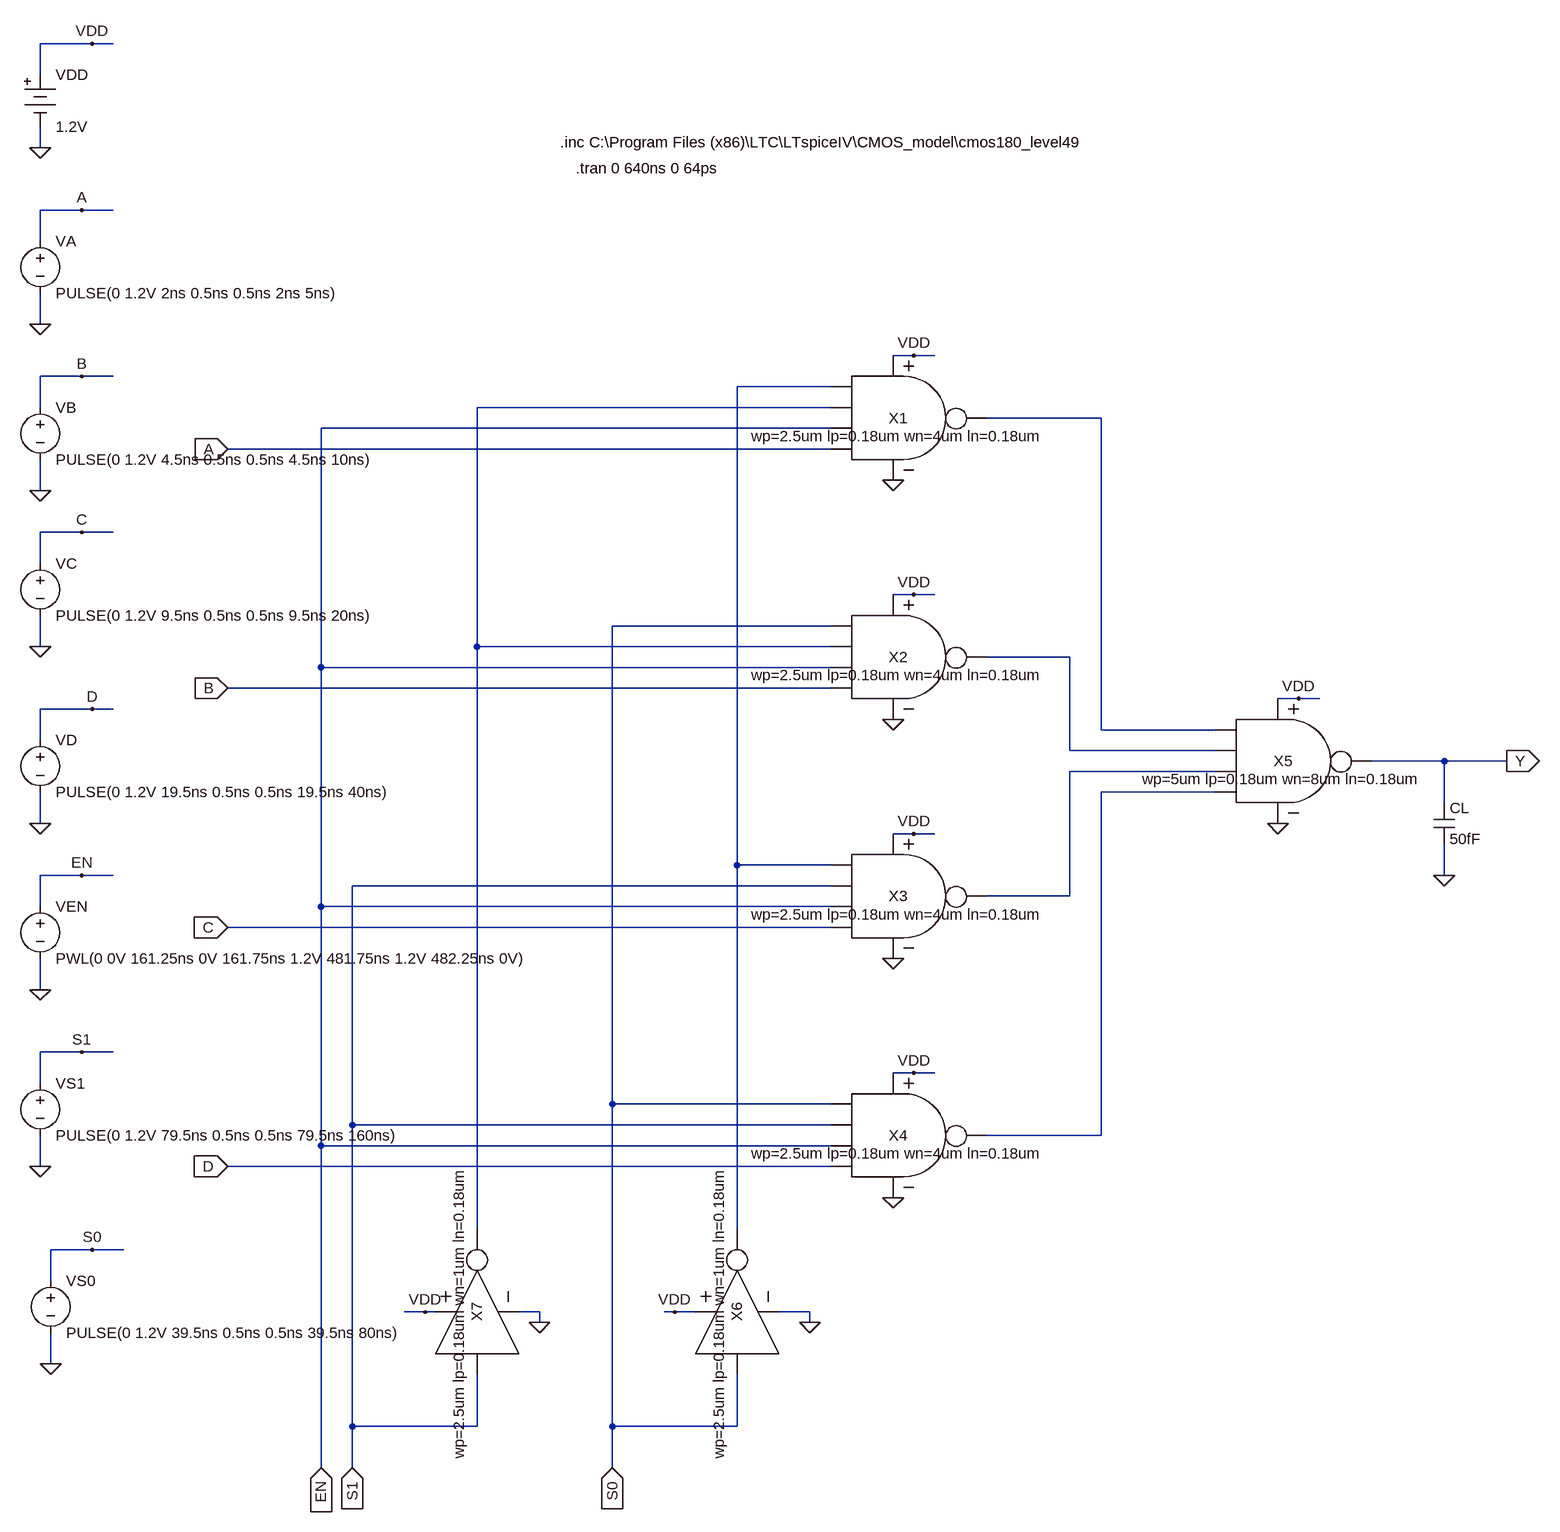
[diagram p0: schematic lab2.asc]
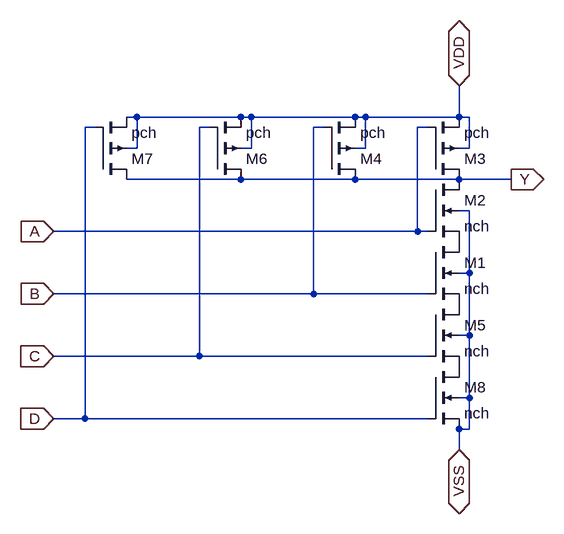
[diagram p1: sub-circuit nand4.asc]
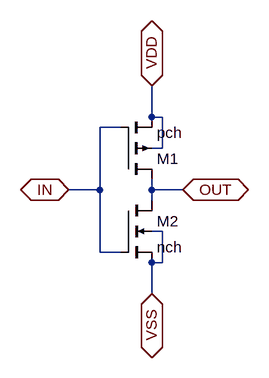
[diagram p2: sub-circuit inv.asc]
lab2.asc, the LTspice schematic file:
Version 4
SHEET 1 2472 2064
WIRE -272 -224 -352 -224
WIRE -240 -224 -272 -224
WIRE -352 -176 -352 -224
WIRE -352 -64 -352 -96
WIRE -288 32 -352 32
WIRE -240 32 -288 32
WIRE -352 80 -352 32
WIRE -352 208 -352 160
WIRE 992 256 960 256
WIRE 1024 256 992 256
WIRE -288 288 -352 288
WIRE -240 288 -288 288
WIRE 864 304 720 304
WIRE -352 336 -352 288
WIRE 864 336 320 336
WIRE 1280 352 1104 352
WIRE 864 368 80 368
WIRE 864 400 -64 400
WIRE -352 464 -352 416
WIRE -288 528 -352 528
WIRE -240 528 -288 528
WIRE -352 576 -352 528
WIRE 992 624 960 624
WIRE 1024 624 992 624
WIRE 864 672 528 672
WIRE -352 704 -352 656
WIRE 320 704 320 336
WIRE 864 704 320 704
WIRE 1232 720 1104 720
WIRE 80 736 80 368
WIRE 864 736 80 736
WIRE 864 768 -64 768
WIRE 1584 784 1552 784
WIRE 1616 784 1584 784
WIRE -272 800 -352 800
WIRE -240 800 -272 800
WIRE 1280 832 1280 352
WIRE 1456 832 1280 832
WIRE -352 848 -352 800
WIRE 1232 864 1232 720
WIRE 1456 864 1232 864
WIRE 1808 880 1696 880
WIRE 1904 880 1808 880
WIRE 1456 896 1232 896
WIRE 1456 928 1280 928
WIRE 1808 944 1808 880
WIRE -352 976 -352 928
WIRE 992 992 960 992
WIRE 1024 992 992 992
WIRE 720 1040 720 304
WIRE 864 1040 720 1040
WIRE -288 1056 -352 1056
WIRE -240 1056 -288 1056
WIRE 1808 1056 1808 1008
WIRE 864 1072 128 1072
WIRE 1232 1088 1232 896
WIRE 1232 1088 1104 1088
WIRE -352 1104 -352 1056
WIRE 80 1104 80 736
WIRE 864 1104 80 1104
WIRE 864 1136 -64 1136
WIRE -352 1232 -352 1184
WIRE -288 1328 -352 1328
WIRE -240 1328 -288 1328
WIRE 992 1360 960 1360
WIRE 1024 1360 992 1360
WIRE -352 1376 -352 1328
WIRE 528 1408 528 672
WIRE 864 1408 528 1408
WIRE 128 1440 128 1072
WIRE 864 1440 128 1440
WIRE 1280 1456 1280 928
WIRE 1280 1456 1104 1456
WIRE 80 1472 80 1104
WIRE 864 1472 80 1472
WIRE -352 1504 -352 1456
WIRE 864 1504 -64 1504
WIRE 320 1600 320 704
WIRE 720 1600 720 1040
WIRE -272 1632 -336 1632
WIRE -224 1632 -272 1632
WIRE -336 1680 -336 1632
WIRE 240 1728 208 1728
WIRE 256 1728 240 1728
WIRE 416 1728 384 1728
WIRE 624 1728 608 1728
WIRE 656 1728 624 1728
WIRE 832 1728 784 1728
WIRE 416 1744 416 1728
WIRE 832 1744 832 1728
WIRE -336 1808 -336 1760
WIRE 128 1904 128 1440
WIRE 320 1904 320 1824
WIRE 320 1904 128 1904
WIRE 528 1904 528 1408
WIRE 720 1904 720 1824
WIRE 720 1904 528 1904
WIRE 80 1968 80 1472
WIRE 128 1968 128 1904
WIRE 528 1968 528 1904
FLAG -352 -64 0
FLAG -272 -224 VDD
FLAG -352 208 0
FLAG -352 464 0
FLAG -352 704 0
FLAG -352 976 0
FLAG -352 1232 0
FLAG -352 1504 0
FLAG -336 1808 0
FLAG -288 32 A
FLAG -288 288 B
FLAG -288 528 C
FLAG -272 800 D
FLAG -288 1056 EN
FLAG -288 1328 S1
FLAG -272 1632 S0
FLAG 960 448 0
FLAG 960 816 0
FLAG 960 1184 0
FLAG 960 1552 0
FLAG 992 256 VDD
FLAG 992 624 VDD
FLAG 992 992 VDD
FLAG 992 1360 VDD
FLAG 1552 976 0
FLAG 1584 784 VDD
FLAG 1808 1056 0
FLAG 1904 880 Y
IOPIN 1904 880 Out
FLAG 240 1728 VDD
FLAG 624 1728 VDD
FLAG 832 1744 0
FLAG 416 1744 0
FLAG 80 1968 EN
IOPIN 80 1968 In
FLAG -64 400 A
IOPIN -64 400 In
FLAG 128 1968 S1
IOPIN 128 1968 In
FLAG 528 1968 S0
IOPIN 528 1968 In
FLAG -64 768 B
IOPIN -64 768 In
FLAG -64 1136 C
IOPIN -64 1136 In
FLAG -64 1504 D
IOPIN -64 1504 In
SYMBOL Misc\\battery -352 -192 R0
WINDOW 123 0 0 Left 2
WINDOW 39 0 0 Left 2
SYMATTR InstName VDD
SYMATTR Value 1.2V
SYMBOL voltage -352 64 R0
WINDOW 123 0 0 Left 2
WINDOW 39 0 0 Left 2
SYMATTR InstName VA
SYMATTR Value PULSE(0 1.2V 2ns 0.5ns 0.5ns 2ns 5ns)
SYMBOL voltage -352 320 R0
SYMATTR InstName VB
SYMATTR Value PULSE(0 1.2V 4.5ns 0.5ns 0.5ns 4.5ns 10ns)
SYMBOL voltage -352 560 R0
SYMATTR InstName VC
SYMATTR Value PULSE(0 1.2V 9.5ns 0.5ns 0.5ns 9.5ns 20ns)
SYMBOL voltage -352 832 R0
SYMATTR InstName VD
SYMATTR Value PULSE(0 1.2V 19.5ns 0.5ns 0.5ns 19.5ns 40ns)
SYMBOL voltage -352 1088 R0
WINDOW 123 0 0 Left 2
WINDOW 39 0 0 Left 2
SYMATTR InstName VEN
SYMATTR Value PWL(0 0V 161.25ns 0V 161.75ns 1.2V 481.75ns 1.2V 482.25ns 0V)
SYMBOL voltage -352 1360 R0
WINDOW 123 0 0 Left 2
WINDOW 39 0 0 Left 2
SYMATTR InstName VS1
SYMATTR Value PULSE(0 1.2V 79.5ns 0.5ns 0.5ns 79.5ns 160ns)
SYMBOL voltage -336 1664 R0
WINDOW 123 0 0 Left 2
WINDOW 39 0 0 Left 2
SYMATTR InstName VS0
SYMATTR Value PULSE(0 1.2V 39.5ns 0.5ns 0.5ns 39.5ns 80ns)
SYMBOL nand4 976 352 R0
WINDOW 39 -8 28 Center 2
SYMATTR SpiceLine wp=2.5um lp=0.18um wn=4um ln=0.18um
SYMATTR InstName X1
SYMBOL nand4 976 720 R0
WINDOW 39 -8 28 Center 2
SYMATTR SpiceLine wp=2.5um lp=0.18um wn=4um ln=0.18um
SYMATTR InstName X2
SYMBOL nand4 976 1088 R0
WINDOW 39 -8 28 Center 2
SYMATTR SpiceLine wp=2.5um lp=0.18um wn=4um ln=0.18um
SYMATTR InstName X3
SYMBOL nand4 976 1456 R0
WINDOW 39 -8 28 Center 2
SYMATTR SpiceLine wp=2.5um lp=0.18um wn=4um ln=0.18um
SYMATTR InstName X4
SYMBOL nand4 1568 880 R0
WINDOW 39 -8 28 Center 2
SYMATTR SpiceLine wp=5um lp=0.18um wn=8um ln=0.18um
SYMATTR InstName X5
SYMBOL cap 1792 944 R0
SYMATTR InstName CL
SYMATTR Value 50fF
SYMBOL inv 720 1728 R270
WINDOW 39 0 -28 Center 2
SYMATTR SpiceLine wp=2.5um lp=0.18um wn=1um ln=0.18um
SYMATTR InstName X6
SYMBOL inv 320 1728 R270
WINDOW 39 0 -28 Center 2
SYMATTR SpiceLine wp=2.5um lp=0.18um wn=1um ln=0.18um
SYMATTR InstName X7
TEXT 448 -72 Left 2 !.inc C:\\Program Files (x86)\\LTC\\LTspiceIV\\CMOS_model\\cmos180_level49
TEXT 472 -32 Left 2 !.tran 0 640ns 0 64ps

nand4.asc, the sub-circuit schematic file:
Version 4
SHEET 1 880 680
WIRE -256 -32 -272 -32
WIRE -96 -32 -256 -32
WIRE -80 -32 -96 -32
WIRE 80 -32 -80 -32
WIRE 96 -32 80 -32
WIRE 240 -32 240 -80
WIRE 240 -32 96 -32
WIRE 256 -32 240 -32
WIRE -320 -16 -336 -16
WIRE -144 -16 -160 -16
WIRE 32 -16 16 -16
WIRE 192 -16 176 -16
WIRE -256 16 -256 -32
WIRE -256 16 -272 16
WIRE -80 16 -80 -32
WIRE -80 16 -96 16
WIRE 96 16 96 -32
WIRE 96 16 80 16
WIRE 256 16 256 -32
WIRE 256 16 240 16
WIRE -96 64 -272 64
WIRE 80 64 -96 64
WIRE 240 64 80 64
WIRE 320 64 240 64
WIRE 256 112 240 112
WIRE 176 144 176 -16
WIRE 176 144 -384 144
WIRE 192 144 176 144
WIRE 256 208 256 112
WIRE 256 208 240 208
WIRE 16 240 16 -16
WIRE 16 240 -384 240
WIRE 192 240 16 240
WIRE 256 304 256 208
WIRE 256 304 240 304
WIRE -160 336 -160 -16
WIRE -160 336 -384 336
WIRE 192 336 -160 336
WIRE 256 400 256 304
WIRE 256 400 240 400
WIRE -336 432 -336 -16
WIRE -336 432 -384 432
WIRE 192 432 -336 432
WIRE 256 448 256 400
WIRE 256 448 240 448
WIRE 240 480 240 448
FLAG -384 144 A
IOPIN -384 144 In
FLAG -384 240 B
IOPIN -384 240 In
FLAG 320 64 Y
IOPIN 320 64 Out
FLAG -384 336 C
IOPIN -384 336 In
FLAG -384 432 D
IOPIN -384 432 In
FLAG 240 480 VSS
IOPIN 240 480 BiDir
FLAG 240 -80 VDD
IOPIN 240 -80 BiDir
SYMBOL nmos4 192 160 R0
SYMATTR InstName M1
SYMATTR Value nch
SYMATTR Value2 l=ln w=wn
SYMBOL nmos4 192 64 R0
SYMATTR InstName M2
SYMATTR Value nch
SYMATTR Value2 l=ln w=wn
SYMBOL pmos4 192 64 M180
SYMATTR InstName M3
SYMATTR Value pch
SYMATTR Value2 l=lp w=wp
SYMBOL pmos4 32 64 M180
SYMATTR InstName M4
SYMATTR Value pch
SYMATTR Value2 l=lp w=wp
SYMBOL nmos4 192 256 R0
SYMATTR InstName M5
SYMATTR Value nch
SYMATTR Value2 l=ln w=wn
SYMBOL pmos4 -144 64 M180
SYMATTR InstName M6
SYMATTR Value pch
SYMATTR Value2 l=lp w=wp
SYMBOL nmos4 192 352 R0
SYMATTR InstName M8
SYMATTR Value nch
SYMATTR Value2 l=ln w=wn
SYMBOL pmos4 -320 64 M180
SYMATTR InstName M7
SYMATTR Value pch
SYMATTR Value2 l=lp w=wp

inv.asc, the sub-circuit schematic file:
Version 4
SHEET 1 880 680
WIRE 240 32 240 -16
WIRE 256 32 240 32
WIRE 192 48 160 48
WIRE 256 80 256 32
WIRE 256 80 240 80
WIRE 160 144 160 48
WIRE 160 144 112 144
WIRE 240 144 240 128
WIRE 288 144 240 144
WIRE 240 160 240 144
WIRE 256 208 240 208
WIRE 160 240 160 144
WIRE 192 240 160 240
WIRE 256 256 256 208
WIRE 256 256 240 256
WIRE 240 304 240 256
FLAG 112 144 IN
IOPIN 112 144 BiDir
FLAG 288 144 OUT
IOPIN 288 144 BiDir
FLAG 240 -16 VDD
IOPIN 240 -16 BiDir
FLAG 240 304 VSS
IOPIN 240 304 BiDir
SYMBOL pmos4 192 128 M180
SYMATTR InstName M1
SYMATTR Value pch
SYMATTR Value2 l=lp w=wp
SYMBOL nmos4 192 160 R0
SYMATTR InstName M2
SYMATTR Value nch
SYMATTR Value2 l=ln w=wn

The netlist it stands for:
* lab2.asc
VDD VDD 0 1.2V
VA A 0 PULSE(0 1.2V 2ns 0.5ns 0.5ns 2ns 5ns)
VB B 0 PULSE(0 1.2V 4.5ns 0.5ns 0.5ns 4.5ns 10ns)
VC C 0 PULSE(0 1.2V 9.5ns 0.5ns 0.5ns 9.5ns 20ns)
VD D 0 PULSE(0 1.2V 19.5ns 0.5ns 0.5ns 19.5ns 40ns)
VEN EN 0 PWL(0 0V 161.25ns 0V 161.75ns 1.2V 481.75ns 1.2V 482.25ns 0V)
VS1 S1 0 PULSE(0 1.2V 79.5ns 0.5ns 0.5ns 79.5ns 160ns)
VS0 S0 0 PULSE(0 1.2V 39.5ns 0.5ns 0.5ns 39.5ns 80ns)
XX1 N001 A N003 N002 EN VDD 0 nand4 params: wp=2.5um lp=0.18um wn=4um ln=0.18um
XX2 S0 B N004 N002 EN VDD 0 nand4 params: wp=2.5um lp=0.18um wn=4um ln=0.18um
XX3 N001 C N005 S1 EN VDD 0 nand4 params: wp=2.5um lp=0.18um wn=4um ln=0.18um
XX4 S0 D N006 S1 EN VDD 0 nand4 params: wp=2.5um lp=0.18um wn=4um ln=0.18um
XX5 N003 N006 Y N004 N005 VDD 0 nand4 params: wp=5um lp=0.18um wn=8um ln=0.18um
CL Y 0 50fF
XX6 S0 N001 VDD 0 inv params: wp=2.5um lp=0.18um wn=1um ln=0.18um
XX7 S1 N002 VDD 0 inv params: wp=2.5um lp=0.18um wn=1um ln=0.18um

* block symbol definitions
.subckt nand4 A D Y B C VDD VSS
M1 P001 B P002 VSS nch l=ln w=wn
M2 Y A P001 VSS nch l=ln w=wn
M3 Y A VDD VDD pch l=lp w=wp
M4 Y B VDD VDD pch l=lp w=wp
M5 P002 C P003 VSS nch l=ln w=wn
M6 Y C VDD VDD pch l=lp w=wp
M8 P003 D VSS VSS nch l=ln w=wn
M7 Y D VDD VDD pch l=lp w=wp
.ends nand4

.subckt inv IN OUT VDD VSS
M1 OUT IN VDD VDD pch l=lp w=wp
M2 OUT IN VSS VSS nch l=ln w=wn
.ends inv

.model NMOS NMOS
.model PMOS PMOS
.lib standard.mos
.inc C:\Program Files (x86)\LTC\LTspiceIV\CMOS_model\cmos180_level49
.tran 0 640ns 0 64ps
.backanno
.end